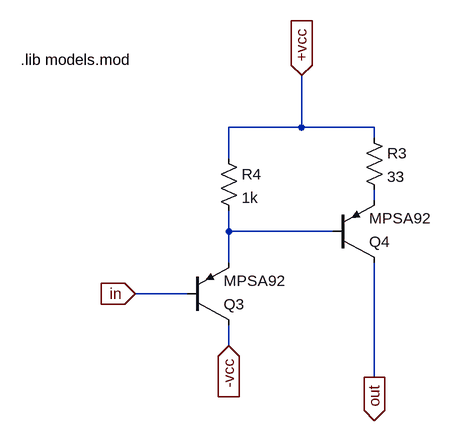
[diagram p0: schematic ss-vas-pnp.asc]
ss-vas-pnp.asc, the LTspice schematic file:
Version 4
SHEET 1 880 680
WIRE -368 -336 -368 -416
WIRE -368 -336 -480 -336
WIRE -256 -336 -368 -336
WIRE -256 -320 -256 -336
WIRE -480 -288 -480 -336
WIRE -256 -224 -256 -240
WIRE -480 -176 -480 -208
WIRE -320 -176 -480 -176
WIRE -480 -128 -480 -176
WIRE -544 -80 -624 -80
WIRE -256 -80 -256 -128
WIRE -480 0 -480 -32
WIRE -256 48 -256 -80
FLAG -368 -416 +vcc
IOPIN -368 -416 In
FLAG -624 -80 in
IOPIN -624 -80 In
FLAG -480 0 -vcc
IOPIN -480 0 In
FLAG -256 48 out
IOPIN -256 48 Out
DATAFLAG -480 -176 "round($*100)/100"
DATAFLAG -256 -80 "round($*100)/100"
SYMBOL pnp -544 -32 M180
SYMATTR InstName Q3
SYMATTR Value MPSA92
SYMBOL pnp -320 -128 M180
SYMATTR InstName Q4
SYMATTR Value MPSA92
SYMBOL res -272 -336 R0
SYMATTR InstName R3
SYMATTR Value 33
SYMBOL res -496 -304 R0
SYMATTR InstName R4
SYMATTR Value 1k
TEXT -800 -440 Left 2 !.lib models.mod

The netlist it stands for:
* ss-vas-pnp.asc
Q3 -vcc in N002 0 MPSA92
Q4 out N002 N001 0 MPSA92
R3 +vcc N001 33
R4 +vcc N002 1k
.model NPN NPN
.model PNP PNP
.lib standard.bjt
.lib models.mod
.backanno
.end